# Altium schematic sheet RK3566pad2.0.SchDoc
size A2; SheetNumber: 1; SheetTotal: 1
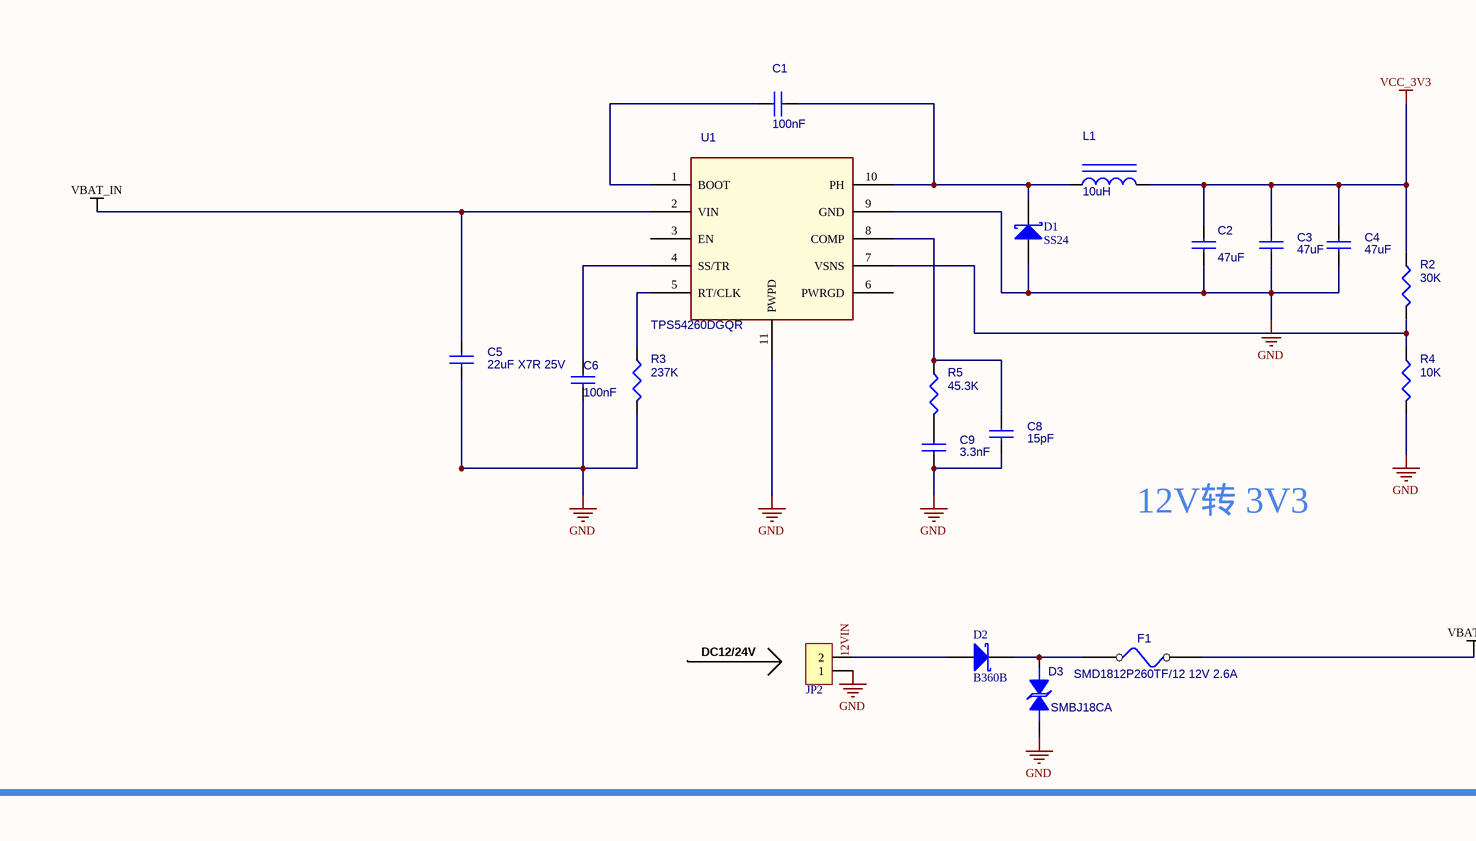
[diagram p0: RK3566pad2.0.SchDoc, top left]
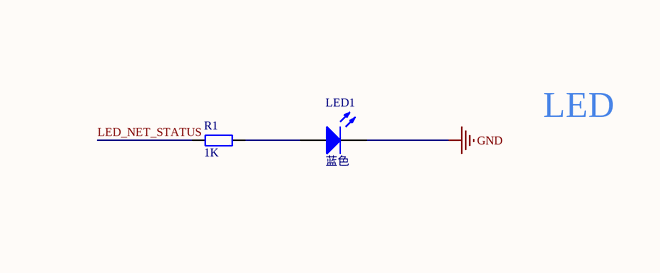
[diagram p1: RK3566pad2.0.SchDoc, top right]
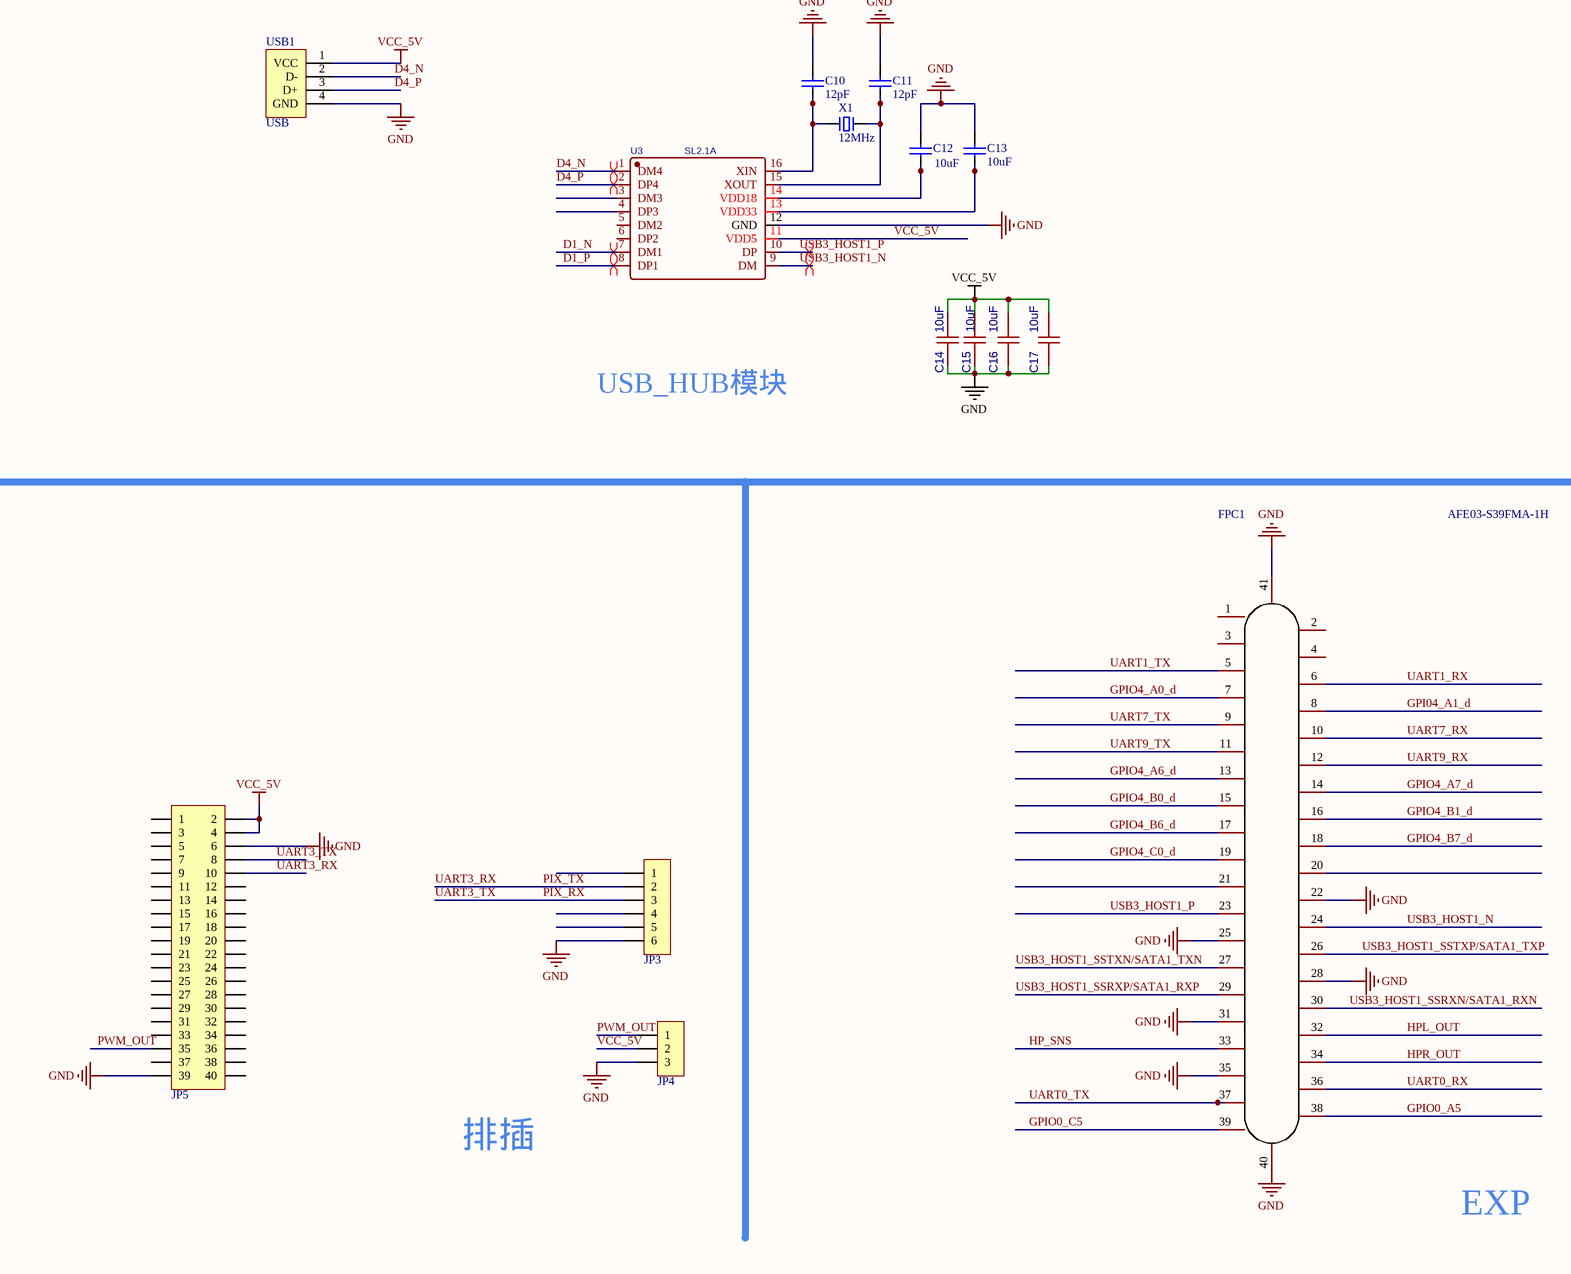
[diagram p2: RK3566pad2.0.SchDoc, bottom left]
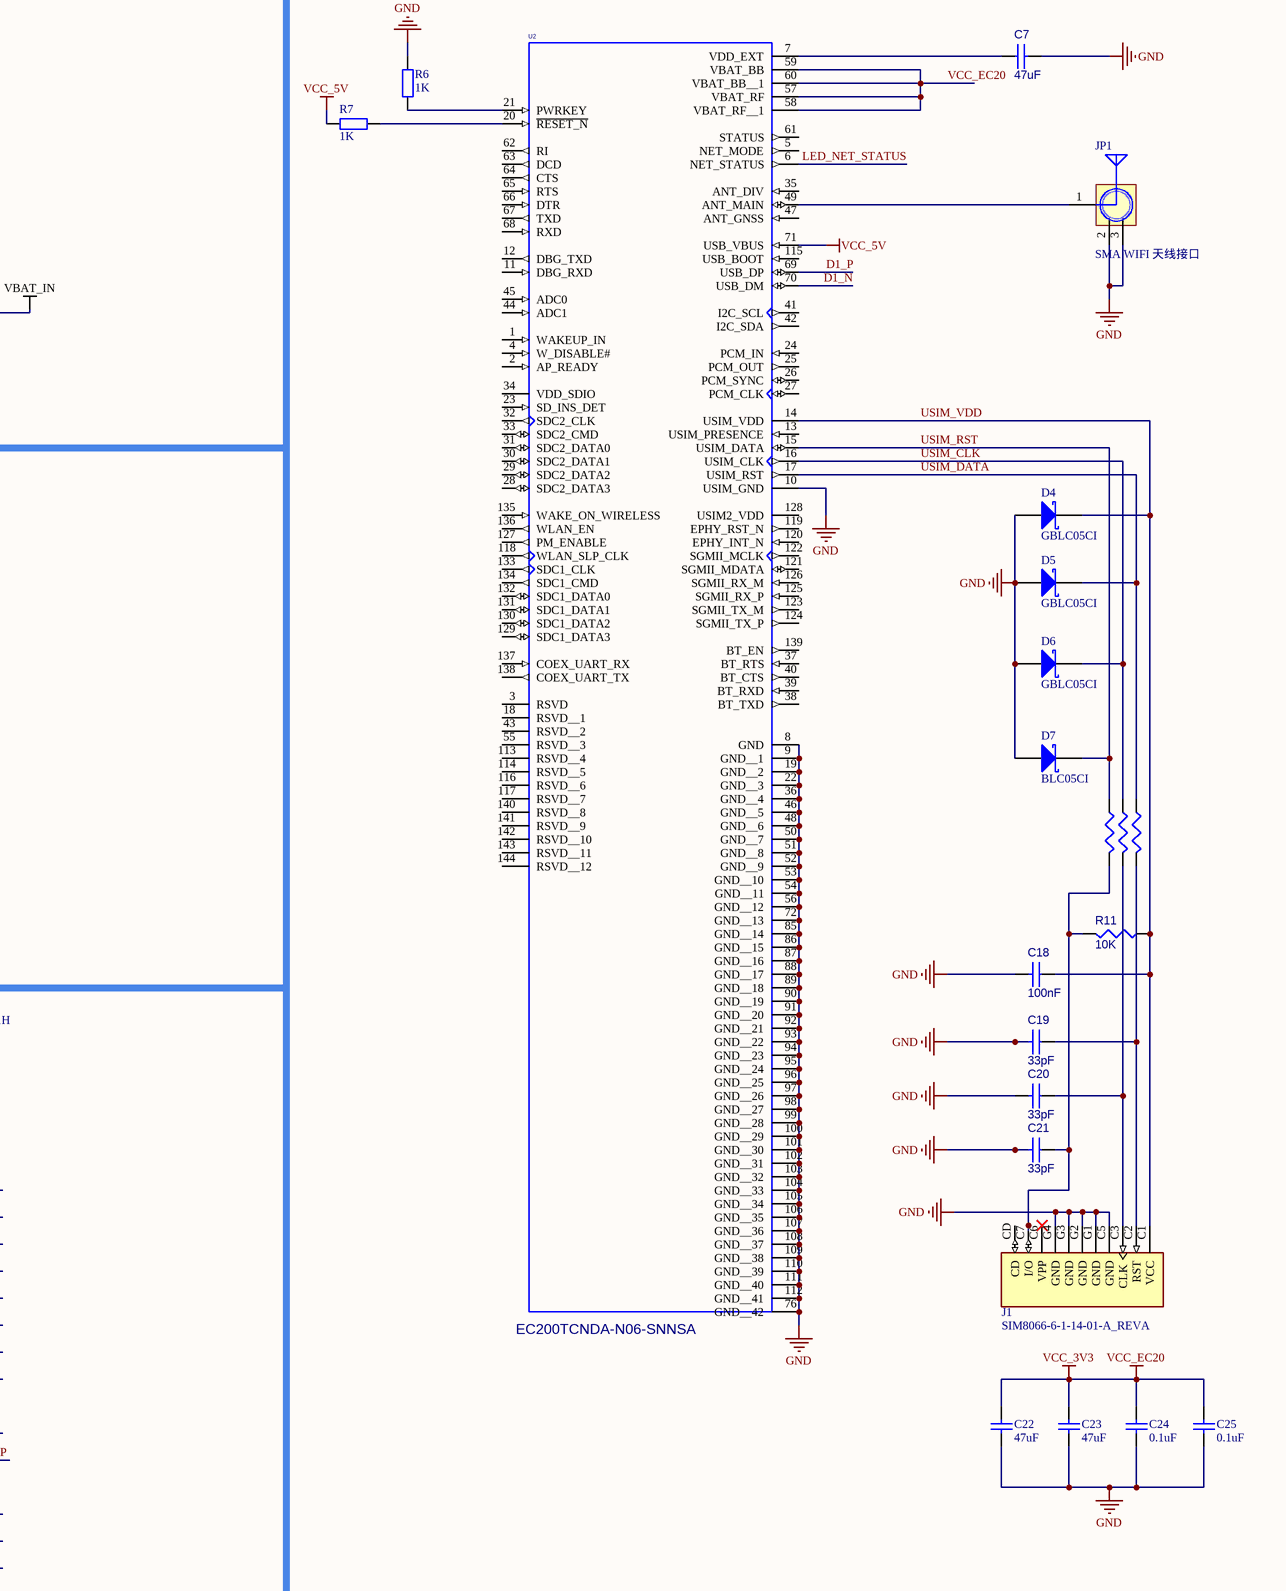
[diagram p3: RK3566pad2.0.SchDoc, bottom right]

## Parts
C1  100nF  [C 0603_L]
C2  47uF  [C 0603_L]
C3  47uF  [C 0603_L]
C4  47uF  [C 0603_L]
C5  22uF X7R 25V  [C 1210_L]
C6  100nF  [C 0603_L]
C7  47uF  [C 0603_L]
C8  15pF  [C 0603_L]
C9  3.3nF  [C 0603_L]
C10  12pF  [C 0603_L]
C11  12pF  [C 0603_L]
C12  10uF  [C 0603_L]
C13  10uF  [C 0603_L]
C14  10uF  [C 0603_L]
C15  10uF  [C 0603_L]
C16  10uF  [C 0603_L]
C17  10uF  [C 0603_L]
C18  100nF  [C 0603_L]
C19  33pF  [C 0603_L]
C20  33pF  [C 0603_L]
C21  33pF  [C 0603_L]
C22  47uF  [C 0603_L]
C23  47uF  [C 0603_L]
C24  0.1uF  [C 0603_L]
C25  0.1uF  [C 0603_L]
D1  SS24  [SMB]
D2  B360B  [SMB]
D3  SMBJ18CA  [smb]
D4  GBLC05CI  [SOD-323]
D5  GBLC05CI  [SOD-323]
D6  GBLC05CI  [SOD-323]
D7  BLC05CI  [SOD-323]
F1  SMD1812P260TF/12 12V 2.6A  [FU 1812]
FPC1  AFE03-S39FMA-1H  [FPC-SMD_P0.30-39P_FGS-XJ-H1.0]
J1  SIM8066-6-1-14-01-A_REVA  [NANO SIM]
JP1  SMA WIFI 天线接口  [COAXIAL/SMD/CON/V/I-PEX/W08-5801]
JP2  HDR-1X2  [MX1.25-WT-2P]  (value not drawn)
JP3  HDR-1X6  [MX1.25-WT-6P]  (value not drawn)
JP4  HDR-1X3  [MX1.25-WT-3P]  (value not drawn)
JP5  Header 2X11  [gudingkong]  (value not drawn)
L1  10uH  [CDRH73]
LED1  蓝色  [LED 0603B]
R1  1K  [R 0603_L]
R2  30K  [R 0603_L]
R3  237K  [R 0603_L]
R4  10K  [R 0603_L]
R5  45.3K  [R 0603_L]
R6  1K  [R 0603_L]
R7  1K  [R 0603_L]
R8  51R  [R 0603_L]  (value not drawn)
R9  51R  [R 0603_L]  (value not drawn)
R10  51R  [R 0603_L]  (value not drawn)
R11  10K  [R 0603_L]
U1  TPS54260DGQR  [SOP50P490X110-11N]
U2  EC200TCNDA-N06-SNNSA  [EC200U]
U3  SL2.1A  [SL2.1A]
USB1  USB  [USB-A/S_C]
X1  12MHz  [OSC 5032-2P]

## Nets
GND: C2.2 C3.2 C4.2 C5.2 C6.2 C7.2 C8.2 C9.2 C10.2 C11.2 C12.2 C13.2 C14.2 C15.2 C16.2 C17.2 C18.2 C19.2 C20.2 C21.2 C22.1 C23.1 C24.1 C25.1 D1.1(A) D3.1 D4.1(A) D5.1(A) D6.1(A) D7.1(A) FPC1.22 FPC1.25 FPC1.28 FPC1.31 FPC1.35 FPC1.40 FPC1.41 J1.C5(GND) J1.G1(GND) J1.G2(GND) J1.G3(GND) J1.G4(GND) JP1.2(GND) JP1.3(GND) JP2.1 JP3.6 JP4.3 JP5.6 JP5.39 LED1.2(K) R3.2 R4.2 R6.2 U1.9(GND) U1.11(PWPD) U2.8(GND) U2.9(GND__1) U2.10(USIM_GND) U2.19(GND__2) U2.22(GND__3) U2.36(GND__4) U2.46(GND__5) U2.48(GND__6) U2.50(GND__7) U2.51(GND__8) U2.52(GND__9) U2.53(GND__10) U2.54(GND__11) U2.56(GND__12) U2.72(GND__13) U2.76(GND__42) U2.85(GND__14) U2.86(GND__15) U2.87(GND__16) U2.88(GND__17) U2.89(GND__18) U2.90(GND__19) U2.91(GND__20) U2.92(GND__21) U2.93(GND__22) U2.94(GND__23) U2.95(GND__24) U2.96(GND__25) U2.97(GND__26) U2.98(GND__27) U2.99(GND__28) U2.100(GND__29) U2.101(GND__30) U2.102(GND__31) U2.103(GND__32) U2.104(GND__33) U2.105(GND__34) U2.106(GND__35) U2.107(GND__36) U2.108(GND__37) U2.109(GND__38) U2.110(GND__39) U2.111(GND__40) U2.112(GND__41) U3.12(GND) USB1.4(GND)
VBAT_IN: C5.1 F1.1 U1.2(VIN)
VCC_5V: C14.1 C15.1 C16.1 C17.1 JP4.2 JP5.2 JP5.4 R7.2 U2.71(USB_VBUS) U3.11(VDD5) USB1.1(VCC)
VCC_EC20: C2.1 C3.1 C4.1 C22.2 C23.2 C24.2 C25.2 L1.2 R2.1 U2.57(VBAT_RF) U2.58(VBAT_RF__1) U2.59(VBAT_BB) U2.60(VBAT_BB__1)  [also labelled VCC_3V3]
12VIN: D2.1(A) JP2.2
D1_N: U2.70(USB_DM) U3.7(DM1)
D1_P: U2.69(USB_DP) U3.8(DP1)
D4_N: U3.1(DM4) USB1.2(D-)
D4_P: U3.2(DP4) USB1.3(D+)
GPI04_A1_d: FPC1.8
GPIO0_A5: FPC1.38
GPIO0_C5: FPC1.39
GPIO4_A0_d: FPC1.7
GPIO4_A6_d: FPC1.13
GPIO4_A7_d: FPC1.14
GPIO4_B0_d: FPC1.15
GPIO4_B1_d: FPC1.16
GPIO4_B6_d: FPC1.17
GPIO4_B7_d: FPC1.18
GPIO4_C0_d: FPC1.19
HP_SNS: FPC1.33
HPL_OUT: FPC1.32
HPR_OUT: FPC1.34
LED_NET_STATUS: R1.2 U2.6(NET_STATUS)
PIX_RX: JP3.3 JP5.8  [also labelled UART3_TX]
PIX_TX: JP3.2 JP5.10  [also labelled UART3_RX]
PWM_OUT: JP4.1 JP5.35
UART0_RX: FPC1.36
UART0_TX: FPC1.37
UART1_RX: FPC1.6
UART1_TX: FPC1.5
UART7_RX: FPC1.10
UART7_TX: FPC1.9
UART9_RX: FPC1.12
UART9_TX: FPC1.11
USB3_HOST1_N: FPC1.24 U3.9(DM)
USB3_HOST1_P: FPC1.23 U3.10(DP)
USB3_HOST1_SSRXN/SATA1_RXN: FPC1.30
USB3_HOST1_SSRXP/SATA1_RXP: FPC1.29
USB3_HOST1_SSTXN/SATA1_TXN: FPC1.27
USB3_HOST1_SSTXP/SATA1_TXP: FPC1.26
USIM_CLK: D6.2(K) R9.1 U2.16(USIM_CLK)
USIM_DATA: D5.2(K) R10.1 U2.17(USIM_RST)
USIM_RST: D7.2(K) R8.1 U2.15(USIM_DATA)
USIM_VDD: C18.1 D4.2(K) J1.C1(VCC) R11.2 U2.14(USIM_VDD)
NetC1_1: C1.1 U1.1(BOOT)
NetC1_2: C1.2 D1.2(K) L1.1 U1.10(PH)
NetC6_1: C6.1 U1.4(SS/TR)
NetC7_1: C7.1 U2.7(VDD_EXT)
NetC8_1: C8.1 R5.1 U1.8(COMP)
NetC9_1: C9.1 R5.2
NetC10_1: C10.1 U3.16(XIN) X1.1
NetC11_1: C11.1 U3.15(XOUT) X1.2
NetC12_1: C12.1 U3.14(VDD18)
NetC13_1: C13.1 U3.13(VDD33)
NetC19_1: C19.1 J1.C2(RST) R10.2
NetC20_1: C20.1 J1.C3(CLK) R9.2
NetC21_1: C21.1 J1.C7(I/O) R8.2 R11.1
NetD2_2: D2.2(K) D3.2 F1.2
NetJP1_1: JP1.1(ANT) U2.49(ANT_MAIN)
NetLED1_1: LED1.1(A) R1.1
NetR2_2: R2.2 R4.1 U1.7(VSNS)
NetR3_1: R3.1 U1.5(RT/CLK)
NetR6_1: R6.1 U2.21(PWRKEY)
NetR7_1: R7.1 U2.20(~{RESET_N})

Not connected (* = marked no-connect by the designer): FPC1 1 2 3 4 20 21; J1 C6(VPP)* CD; JP3 1 4 5; JP5 1 3 5 7 9 11 12 13 14 15 16 17 18 19 20 21 22 23 24 25 26 27 28 29 30 31 32 33 34 36 37 38 40; U1 3(EN) 6(PWRGD); U2 1(WAKEUP_IN) 2(AP_READY) 3(RSVD) 4(W_DISABLE#) 5(NET_MODE) 11(DBG_RXD) 12(DBG_TXD) 13(USIM_PRESENCE) 18(RSVD__1) 23(SD_INS_DET) 24(PCM_IN) 25(PCM_OUT) 26(PCM_SYNC) 27(PCM_CLK) 28(SDC2_DATA3) 29(SDC2_DATA2) 30(SDC2_DATA1) 31(SDC2_DATA0) 32(SDC2_CLK) 33(SDC2_CMD) 34(VDD_SDIO) 35(ANT_DIV) 37(BT_RTS) 38(BT_TXD) 39(BT_RXD) 40(BT_CTS) 41(I2C_SCL) 42(I2C_SDA) 43(RSVD__2) 44(ADC1) 45(ADC0) 47(ANT_GNSS) 55(RSVD__3) 61(STATUS) 62(RI) 63(DCD) 64(CTS) 65(RTS) 66(DTR) 67(TXD) 68(RXD) 113(RSVD__4) 114(RSVD__5) 115(USB_BOOT) 116(RSVD__6) 117(RSVD__7) 118(WLAN_SLP_CLK) 119(EPHY_RST_N) 120(EPHY_INT_N) 121(SGMII_MDATA) 122(SGMII_MCLK) 123(SGMII_TX_M) 124(SGMII_TX_P) 125(SGMII_RX_P) 126(SGMII_RX_M) 127(PM_ENABLE) 128(USIM2_VDD) 129(SDC1_DATA3) 130(SDC1_DATA2) 131(SDC1_DATA1) 132(SDC1_DATA0) 133(SDC1_CLK) 134(SDC1_CMD) 135(WAKE_ON_WIRELESS) 136(WLAN_EN) 137(COEX_UART_RX) 138(COEX_UART_TX) 139(BT_EN) 140(RSVD__8) 141(RSVD__9) 142(RSVD__10) 143(RSVD__11) 144(RSVD__12); U3 3(DM3) 4(DP3) 5(DM2) 6(DP2)

## Layout directives
differential pair: D1_N, D1_P, D4_N, D4_P, USB3_HOST1_N, USB3_HOST1_P

## Notes on the sheet
- LED
- 12V转 3V3
- DC12/24V
- USB_HUB模块
- 排插
- EXP

## Library data of the parts
C1 C6 C8 C9 = CAP NP: Part Number: CAPC0402; ROOM: DC/DC_3V8
C2-C4 = CAP NP: Part Number: CAPC0805; ROOM: DC/DC_3V8
C5 = CAP NP: Part Number: CAPC0805
C7 C18-C21 = CAP NP: Part Number: CAPC0402; ROOM: Modem
C10-C13 C22-C25 = C_12: 贴片电容/MLCC电容; BOM名称: 无极性贴片电容; 联系下单店铺卖家 免费帮你查找封装: 联系下单店铺卖家 免费技术支持
C14-C17 = 10uF: BOM_Manufacturer: Murata Electronics; BOM_Manufacturer Part: GRM188R61E106KA73D; nameAlias: Capacitance; Contributor: LCSC; BOM_Supplier: LCSC; BOM_Supplier Part: C344022; spicePre: C; spiceSymbolName: GRM188R61E106KA73D
D1 D2 = SS24: 肖特基二极管; 属性: 40V/2A; BOM名称: 肖特基二极管; 封装库来自淘宝 ID：黄晶宝石: https://shop463601444.taobao.com
D3 = DIODE TS BI-DIR: 这个很容易坏; Part Number: SMAJ13CA; ROOM: VIN
D4-D7 = 1N5819: 肖特基二极管; 淘宝ID: 封装库来自淘宝 ID：黄晶宝石; 属性: 40V/2A; BOM名称: 肖特基二极管; 欢迎光临: https://shop463601444.taobao.com
F1 = FUSE: ROOM: VIN; Part Number: SMD1812P260TF/12
FPC1 = AFE03-S39FMA-1H: 间距:0.3mm;触点数量:39;锁定特性:翻盖式;安装类型:卧贴;触点类型:下接;; Manufacturer: JS(钜硕电子); Add into BOM: yes; Pitch: 0.3mm; Number of Contacts: 39; Locking Feature: 翻盖式; FFC, FCB Thickness: 0.2mm; Name: AFE03-S39FMA-1H; Symbol: AFE03-S39FMA-1H; Device: AFE03-S39FMA-1H; LCSC Part Name: 0.3mm P数:39 翻盖式 下接; Supplier Part: C262546; Manufacturer Part: AFE03-S39FMA-1H; Supplier Footprint: SMD,P=0.3mm; Datasheet: https://atta.szlcsc.com/upload/public/pdf/source/20180810/C262546_FD07BEB9163FBD4C911947212CF39B0D.pdf; Supplier: LCSC; Convert to PCB: yes; Mounting Type: 卧贴; Contact Type: 下接; Height Above Board: 1mm
J1 = SIM8066-6-1-14-01-A_REVA: Nano SIM Card ConnectorPush-Push Type, SMT, 6Pin, 1.44mm Profile; MF: Global Connector Technology; SnapEDA_Link: https://www.snapeda.com/parts/SIM8066-6-1-14-01-A/Global%20Connector%20Technology/view-part/5720957/?ref=snap; Value: *; MP: SIM8066-6-1-14-01-A; Package: None; Check_prices: https://www.snapeda.com/parts/SIM8066-6-1-14-01-A/Global%20Connector%20Technology/view-part/5720957/?ref=eda; Price: None; Availability: Unavailable
JP1 = SMA: SMA-2.4G射频天线接口; 联系卖家，免费技术支持: 唯一出售店铺网址https://shop463601444.taobao.com; BOM名称: SMA-2.4G射频天线接口
JP2 = Header 2: 2P接插件; 版权归属: 封装库来自淘宝 ID：黄晶宝石; BOM名称: 2P接插件; 联系售后: https://shop463601444.taobao.com
JP3 = Header 6: 6P连接器; 联系卖家 免费技术支持: 封装库来自淘宝卖家ID：黄晶宝石; BOM名称: 6P连接器
JP4 = Header 3: 3P接插件; 版权归属: 封装库来自淘宝 ID：黄晶宝石; BOM名称: 3P接插件; 学习资源: https://shop463601444.taobao.com
JP5 = Header 20X2: 20*2P接插件; 联系卖家，免费查找封装: 唯一出售店铺网址https://shop463601444.taobao.com; 封装库来自淘宝卖家ID：黄晶宝石: 其他店铺购入均为盗版封装库，请立即申请退款，本店现金奖励50~200元; BOM名称: 20*2P接插件
L1 = INDUCTOR IRON: Part Number: MHCC10040-100M-R7; ROOM: DC/DC_3V8
LED1 = LED: 贴片LED; 封装库来自淘宝卖家：黄晶宝石: 其他店铺购入均为盗版封装库，无更新权益，退款现金奖励200~1000元; BOM名称: 贴片LED
R1 R6 R7 = R: 贴片电阻; 当前库版本V2022.10.7 @黄晶宝石: 最新版本发布https://shop463601444.taobao.com; BOM名称: 贴片电阻
R2-R5 = R: Part Number: RESC0402; ROOM: DC/DC_3V8
R8-R11 = R: Part Number: RESC0402; ROOM: Modem
U1 = TPS54260: ROOM: DC/DC_3V8; Part Number: TPS54260
U2 = EC20CEFILG-128-SGNS: Quectel EC25 is a series of LTE Cat 4 module optimized specially for M2M and IoT applications.; OriginalSymbolOrigin: (-90000,250000); MP: EC25-AU; ROOM: Modem; Price: None; Package: None; MF: Quectel; Availability: Unavailable; Part Number: EC20CEFILG-128-SGNS
U3 = SL2.1A: BOM_Manufacturer: CoreChips; Contributor: LCSC; BOM_Supplier: LCSC; BOM_Supplier Part: C192893; BOM_Manufacturer Part: SL2.1A; spicePre: U
USB1 = USB-A/S: USB-A型母接口; 版权归属: 封装库来自淘宝 ID：黄晶宝石; BOM名称: USB-A型母接口; 学习资源: https://shop463601444.taobao.com
X1 = XTAL-2P: 2脚无源脚晶振; 版权归属: 源创客; BOM名称: 2脚无源脚晶振; 学习资源: www.ooocke.com